# Altium schematic sheet Digital In-Out.SchDoc
size A2
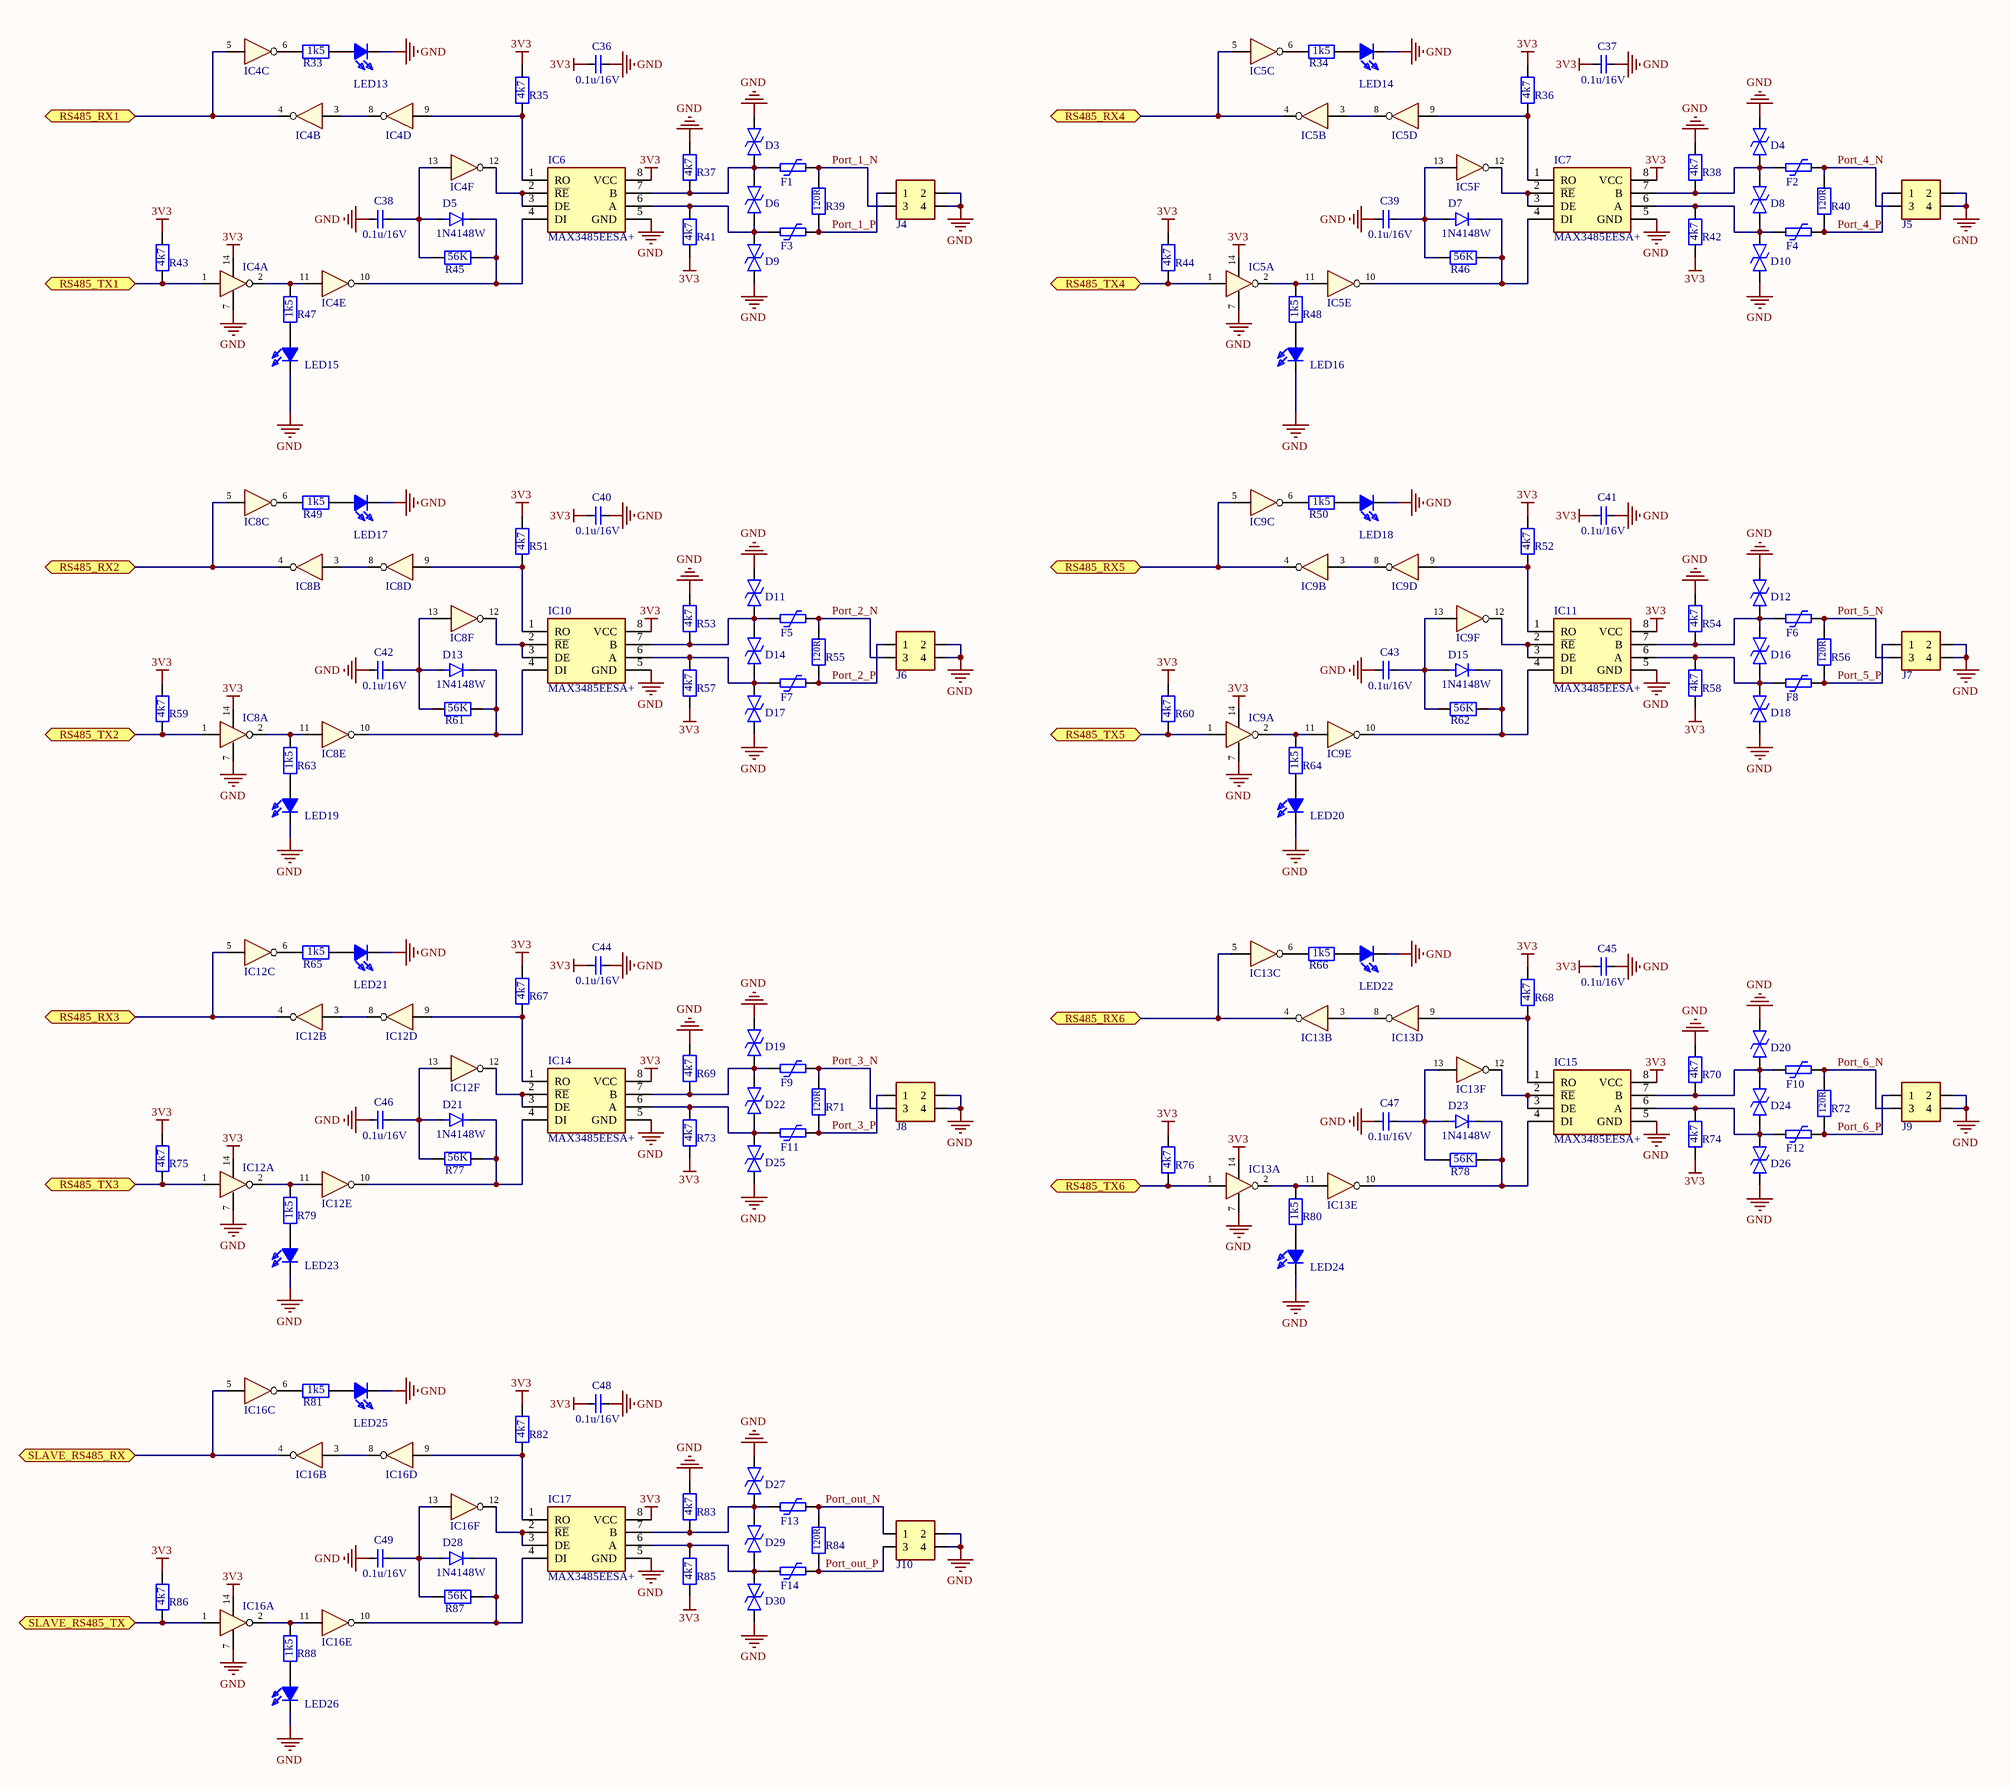
[diagram p0: Digital In-Out.SchDoc]

## Parts
C36  0.1u/16V  [CAPC1608X95N]
C37  0.1u/16V  [CAPC1608X95N]
C38  0.1u/16V  [CAPC1608X95N]
C39  0.1u/16V  [CAPC1608X95N]
C40  0.1u/16V  [CAPC1608X95N]
C41  0.1u/16V  [CAPC1608X95N]
C42  0.1u/16V  [CAPC1608X95N]
C43  0.1u/16V  [CAPC1608X95N]
C44  0.1u/16V  [CAPC1608X95N]
C45  0.1u/16V  [CAPC1608X95N]
C46  0.1u/16V  [CAPC1608X95N]
C47  0.1u/16V  [CAPC1608X95N]
C48  0.1u/16V  [CAPC1608X95N]
C49  0.1u/16V  [CAPC1608X95N]
D3  SMAJ6.8CA  [DIOM5226X247N]  (value not drawn)
D4  SMAJ6.8CA  [DIOM5226X247N]  (value not drawn)
D5  1N4148W  [SOD3716X135N]
D6  SMAJ6.8CA  [DIOM5226X247N]  (value not drawn)
D7  1N4148W  [SOD3716X135N]
D8  SMAJ6.8CA  [DIOM5226X247N]  (value not drawn)
D9  SMAJ6.8CA  [DIOM5226X247N]  (value not drawn)
D10  SMAJ6.8CA  [DIOM5226X247N]  (value not drawn)
D11  SMAJ6.8CA  [DIOM5226X247N]  (value not drawn)
D12  SMAJ6.8CA  [DIOM5226X247N]  (value not drawn)
D13  1N4148W  [SOD3716X135N]
D14  SMAJ6.8CA  [DIOM5226X247N]  (value not drawn)
D15  1N4148W  [SOD3716X135N]
D16  SMAJ6.8CA  [DIOM5226X247N]  (value not drawn)
D17  SMAJ6.8CA  [DIOM5226X247N]  (value not drawn)
D18  SMAJ6.8CA  [DIOM5226X247N]  (value not drawn)
D19  SMAJ6.8CA  [DIOM5226X247N]  (value not drawn)
D20  SMAJ6.8CA  [DIOM5226X247N]  (value not drawn)
D21  1N4148W  [SOD3716X135N]
D22  SMAJ6.8CA  [DIOM5226X247N]  (value not drawn)
D23  1N4148W  [SOD3716X135N]
D24  SMAJ6.8CA  [DIOM5226X247N]  (value not drawn)
D25  SMAJ6.8CA  [DIOM5226X247N]  (value not drawn)
D26  SMAJ6.8CA  [DIOM5226X247N]  (value not drawn)
D27  SMAJ6.8CA  [DIOM5226X247N]  (value not drawn)
D28  1N4148W  [SOD3716X135N]
D29  SMAJ6.8CA  [DIOM5226X247N]  (value not drawn)
D30  SMAJ6.8CA  [DIOM5226X247N]  (value not drawn)
F1  USHT020KX  [MFUSHT020KX362]  (value not drawn)
F2  USHT020KX  [MFUSHT020KX362]  (value not drawn)
F3  USHT020KX  [MFUSHT020KX362]  (value not drawn)
F4  USHT020KX  [MFUSHT020KX362]  (value not drawn)
F5  USHT020KX  [MFUSHT020KX362]  (value not drawn)
F6  USHT020KX  [MFUSHT020KX362]  (value not drawn)
F7  USHT020KX  [MFUSHT020KX362]  (value not drawn)
F8  USHT020KX  [MFUSHT020KX362]  (value not drawn)
F9  USHT020KX  [MFUSHT020KX362]  (value not drawn)
F10  USHT020KX  [MFUSHT020KX362]  (value not drawn)
F11  USHT020KX  [MFUSHT020KX362]  (value not drawn)
F12  USHT020KX  [MFUSHT020KX362]  (value not drawn)
F13  USHT020KX  [MFUSHT020KX362]  (value not drawn)
F14  USHT020KX  [MFUSHT020KX362]  (value not drawn)
IC4  nverters Hex A 595-CD4069UBMT  [SOIC127P600X175-14N]  (value not drawn)  (parts A,B,C,D,E,F of 6)
IC5  nverters Hex A 595-CD4069UBMT  [SOIC127P600X175-14N]  (value not drawn)  (parts A,B,C,D,E,F of 6)
IC6  MAX3485EESA+  [SOIC127P600X175-8N]
IC7  MAX3485EESA+  [SOIC127P600X175-8N]
IC8  nverters Hex A 595-CD4069UBMT  [SOIC127P600X175-14N]  (value not drawn)  (parts A,B,C,D,E,F of 6)
IC9  nverters Hex A 595-CD4069UBMT  [SOIC127P600X175-14N]  (value not drawn)  (parts A,B,C,D,E,F of 6)
IC10  MAX3485EESA+  [SOIC127P600X175-8N]
IC11  MAX3485EESA+  [SOIC127P600X175-8N]
IC12  nverters Hex A 595-CD4069UBMT  [SOIC127P600X175-14N]  (value not drawn)  (parts A,B,C,D,E,F of 6)
IC13  nverters Hex A 595-CD4069UBMT  [SOIC127P600X175-14N]  (value not drawn)  (parts A,B,C,D,E,F of 6)
IC14  MAX3485EESA+  [SOIC127P600X175-8N]
IC15  MAX3485EESA+  [SOIC127P600X175-8N]
IC16  nverters Hex A 595-CD4069UBMT  [SOIC127P600X175-14N]  (value not drawn)  (parts A,B,C,D,E,F of 6)
IC17  MAX3485EESA+  [SOIC127P600X175-8N]
J4  Connector THD 4 position 0.165" (4.20mm)  [RHDR4W125P550X420_2X2_960X960X1310P]  (value not drawn)
J5  Connector THD 4 position 0.165" (4.20mm)  [RHDR4W125P550X420_2X2_960X960X1310P]  (value not drawn)
J6  Connector THD 4 position 0.165" (4.20mm)  [RHDR4W125P550X420_2X2_960X960X1310P]  (value not drawn)
J7  Connector THD 4 position 0.165" (4.20mm)  [RHDR4W125P550X420_2X2_960X960X1310P]  (value not drawn)
J8  Connector THD 4 position 0.165" (4.20mm)  [RHDR4W125P550X420_2X2_960X960X1310P]  (value not drawn)
J9  Connector THD 4 position 0.165" (4.20mm)  [RHDR4W125P550X420_2X2_960X960X1310P]  (value not drawn)
J10  Connector THD 4 position 0.165" (4.20mm)  [RHDR4W125P550X420_2X2_960X960X1310P]  (value not drawn)
LED13  LED0603_BLUE  [LEDC1608X80N]  (value not drawn)
LED14  LED0603_BLUE  [LEDC1608X80N]  (value not drawn)
LED15  LED0603_BLUE  [LEDC1608X80N]  (value not drawn)
LED16  LED0603_BLUE  [LEDC1608X80N]  (value not drawn)
LED17  LED0603_BLUE  [LEDC1608X80N]  (value not drawn)
LED18  LED0603_BLUE  [LEDC1608X80N]  (value not drawn)
LED19  LED0603_BLUE  [LEDC1608X80N]  (value not drawn)
LED20  LED0603_BLUE  [LEDC1608X80N]  (value not drawn)
LED21  LED0603_BLUE  [LEDC1608X80N]  (value not drawn)
LED22  LED0603_BLUE  [LEDC1608X80N]  (value not drawn)
LED23  LED0603_BLUE  [LEDC1608X80N]  (value not drawn)
LED24  LED0603_BLUE  [LEDC1608X80N]  (value not drawn)
LED25  LED0603_BLUE  [LEDC1608X80N]  (value not drawn)
LED26  LED0603_BLUE  [LEDC1608X80N]  (value not drawn)
R33  Res 0603 1k5  [RESC1608X55N]  (value not drawn)
R34  Res 0603 1k5  [RESC1608X55N]  (value not drawn)
R35  Res 0603 4k7  [RESC1608X55N]  (value not drawn)
R36  Res 0603 4k7  [RESC1608X55N]  (value not drawn)
R37  Res 0603 4k7  [RESC1608X55N]  (value not drawn)
R38  Res 0603 4k7  [RESC1608X55N]  (value not drawn)
R39  120R  [RESC1608X55N]  (value not drawn)
R40  120R  [RESC1608X55N]  (value not drawn)
R41  Res 0603 4k7  [RESC1608X55N]  (value not drawn)
R42  Res 0603 4k7  [RESC1608X55N]  (value not drawn)
R43  Res 0603 4k7  [RESC1608X55N]  (value not drawn)
R44  Res 0603 4k7  [RESC1608X55N]  (value not drawn)
R45  56k  [RESC1608X55N]  (value not drawn)
R46  56k  [RESC1608X55N]  (value not drawn)
R47  Res 0603 1k5  [RESC1608X55N]  (value not drawn)
R48  Res 0603 1k5  [RESC1608X55N]  (value not drawn)
R49  Res 0603 1k5  [RESC1608X55N]  (value not drawn)
R50  Res 0603 1k5  [RESC1608X55N]  (value not drawn)
R51  Res 0603 4k7  [RESC1608X55N]  (value not drawn)
R52  Res 0603 4k7  [RESC1608X55N]  (value not drawn)
R53  Res 0603 4k7  [RESC1608X55N]  (value not drawn)
R54  Res 0603 4k7  [RESC1608X55N]  (value not drawn)
R55  120R  [RESC1608X55N]  (value not drawn)
R56  120R  [RESC1608X55N]  (value not drawn)
R57  Res 0603 4k7  [RESC1608X55N]  (value not drawn)
R58  Res 0603 4k7  [RESC1608X55N]  (value not drawn)
R59  Res 0603 4k7  [RESC1608X55N]  (value not drawn)
R60  Res 0603 4k7  [RESC1608X55N]  (value not drawn)
R61  56k  [RESC1608X55N]  (value not drawn)
R62  56k  [RESC1608X55N]  (value not drawn)
R63  Res 0603 1k5  [RESC1608X55N]  (value not drawn)
R64  Res 0603 1k5  [RESC1608X55N]  (value not drawn)
R65  Res 0603 1k5  [RESC1608X55N]  (value not drawn)
R66  Res 0603 1k5  [RESC1608X55N]  (value not drawn)
R67  Res 0603 4k7  [RESC1608X55N]  (value not drawn)
R68  Res 0603 4k7  [RESC1608X55N]  (value not drawn)
R69  Res 0603 4k7  [RESC1608X55N]  (value not drawn)
R70  Res 0603 4k7  [RESC1608X55N]  (value not drawn)
R71  120R  [RESC1608X55N]  (value not drawn)
R72  120R  [RESC1608X55N]  (value not drawn)
R73  Res 0603 4k7  [RESC1608X55N]  (value not drawn)
R74  Res 0603 4k7  [RESC1608X55N]  (value not drawn)
R75  Res 0603 4k7  [RESC1608X55N]  (value not drawn)
R76  Res 0603 4k7  [RESC1608X55N]  (value not drawn)
R77  56k  [RESC1608X55N]  (value not drawn)
R78  56k  [RESC1608X55N]  (value not drawn)
R79  Res 0603 1k5  [RESC1608X55N]  (value not drawn)
R80  Res 0603 1k5  [RESC1608X55N]  (value not drawn)
R81  Res 0603 1k5  [RESC1608X55N]  (value not drawn)
R82  Res 0603 4k7  [RESC1608X55N]  (value not drawn)
R83  Res 0603 4k7  [RESC1608X55N]  (value not drawn)
R84  120R  [RESC1608X55N]  (value not drawn)
R85  Res 0603 4k7  [RESC1608X55N]  (value not drawn)
R86  Res 0603 4k7  [RESC1608X55N]  (value not drawn)
R87  56k  [RESC1608X55N]  (value not drawn)
R88  Res 0603 1k5  [RESC1608X55N]  (value not drawn)

## Ports
RS485_RX1 (bidir), RS485_RX2 (bidir), RS485_RX3 (bidir), RS485_RX4 (bidir), RS485_RX5 (bidir), RS485_RX6 (bidir), RS485_TX1 (bidir), RS485_TX2 (bidir), RS485_TX3 (bidir), RS485_TX4 (bidir), RS485_TX5 (bidir), RS485_TX6 (bidir), SLAVE_RS485_RX (bidir), SLAVE_RS485_TX (bidir)

## Nets
3V3: C36.1 C37.1 C40.1 C41.1 C44.1 C45.1 C48.1 IC4.14(VDD) IC5.14(VDD) IC6.8(VCC) IC7.8(VCC) IC8.14(VDD) IC9.14(VDD) IC10.8(VCC) IC11.8(VCC) IC12.14(VDD) IC13.14(VDD) IC14.8(VCC) IC15.8(VCC) IC16.14(VDD) IC17.8(VCC) R35.2 R36.2 R41.1 R42.1 R43.2 R44.2 R51.2 R52.2 R57.1 R58.1 R59.2 R60.2 R67.2 R68.2 R73.1 R74.1 R75.2 R76.2 R82.2 R85.1 R86.2
GND: C36.2 C37.2 C38.1 C39.1 C40.2 C41.2 C42.1 C43.1 C44.2 C45.2 C46.1 C47.1 C48.2 C49.1 D3.2 D4.2 D9.1 D10.1 D11.2 D12.2 D17.1 D18.1 D19.2 D20.2 D25.1 D26.1 D27.2 D30.1 IC4.7(VSS) IC5.7(VSS) IC6.5(GND) IC7.5(GND) IC8.7(VSS) IC9.7(VSS) IC10.5(GND) IC11.5(GND) IC12.7(VSS) IC13.7(VSS) IC14.5(GND) IC15.5(GND) IC16.7(VSS) IC17.5(GND) J4.2 J4.4 J5.2 J5.4 J6.2 J6.4 J7.2 J7.4 J8.2 J8.4 J9.2 J9.4 J10.2 J10.4 LED13.1(K) LED14.1(K) LED15.1(K) LED16.1(K) LED17.1(K) LED18.1(K) LED19.1(K) LED20.1(K) LED21.1(K) LED22.1(K) LED23.1(K) LED24.1(K) LED25.1(K) LED26.1(K) R37.2 R38.2 R53.2 R54.2 R69.2 R70.2 R83.2
Port_1_N: F1.2 J4.3 R39.2
Port_1_P: F3.2 J4.1 R39.1
Port_2_N: F5.2 J6.3 R55.2
Port_2_P: F7.2 J6.1 R55.1
Port_3_N: F9.2 J8.3 R71.2
Port_3_P: F11.2 J8.1 R71.1
Port_4_N: F2.2 J5.3 R40.2
Port_4_P: F4.2 J5.1 R40.1
Port_5_N: F6.2 J7.3 R56.2
Port_5_P: F8.2 J7.1 R56.1
Port_6_N: F10.2 J9.3 R72.2
Port_6_P: F12.2 J9.1 R72.1
Port_out_N: F13.2 J10.1 R84.2
Port_out_P: F14.2 J10.3 R84.1
RS485_RX1: IC4.4(H=~{B}) IC4.5(C) ; port RS485_RX1
RS485_RX2: IC8.4(H=~{B}) IC8.5(C) ; port RS485_RX2
RS485_RX3: IC12.4(H=~{B}) IC12.5(C) ; port RS485_RX3
RS485_RX4: IC5.4(H=~{B}) IC5.5(C) ; port RS485_RX4
RS485_RX5: IC9.4(H=~{B}) IC9.5(C) ; port RS485_RX5
RS485_RX6: IC13.4(H=~{B}) IC13.5(C) ; port RS485_RX6
RS485_TX1: IC4.1(A) R43.1 ; port RS485_TX1
RS485_TX2: IC8.1(A) R59.1 ; port RS485_TX2
RS485_TX3: IC12.1(A) R75.1 ; port RS485_TX3
RS485_TX4: IC5.1(A) R44.1 ; port RS485_TX4
RS485_TX5: IC9.1(A) R60.1 ; port RS485_TX5
RS485_TX6: IC13.1(A) R76.1 ; port RS485_TX6
SLAVE_RS485_RX: IC16.4(H=~{B}) IC16.5(C) ; port SLAVE_RS485_RX
SLAVE_RS485_TX: IC16.1(A) R86.1 ; port SLAVE_RS485_TX
NetC38_2: C38.2 D5.2(A) IC4.13(F) R45.1
NetC39_2: C39.2 D7.2(A) IC5.13(F) R46.1
NetC42_2: C42.2 D13.2(A) IC8.13(F) R61.1
NetC43_2: C43.2 D15.2(A) IC9.13(F) R62.1
NetC46_2: C46.2 D21.2(A) IC12.13(F) R77.1
NetC47_2: C47.2 D23.2(A) IC13.13(F) R78.1
NetC49_2: C49.2 D28.2(A) IC16.13(F) R87.1
NetD3_1: D3.1 D6.2 F1.1 IC6.7(B) R37.1
NetD4_1: D4.1 D8.2 F2.1 IC7.7(B) R38.1
NetD5_1: D5.1(K) IC4.10(K=~{E}) IC6.4(DI) R45.2
NetD6_1: D6.1 D9.2 F3.1 IC6.6(A) R41.2
NetD7_1: D7.1(K) IC5.10(K=~{E}) IC7.4(DI) R46.2
NetD8_1: D8.1 D10.2 F4.1 IC7.6(A) R42.2
NetD11_1: D11.1 D14.2 F5.1 IC10.7(B) R53.1
NetD12_1: D12.1 D16.2 F6.1 IC11.7(B) R54.1
NetD13_1: D13.1(K) IC8.10(K=~{E}) IC10.4(DI) R61.2
NetD14_1: D14.1 D17.2 F7.1 IC10.6(A) R57.2
NetD15_1: D15.1(K) IC9.10(K=~{E}) IC11.4(DI) R62.2
NetD16_1: D16.1 D18.2 F8.1 IC11.6(A) R58.2
NetD19_1: D19.1 D22.2 F9.1 IC14.7(B) R69.1
NetD20_1: D20.1 D24.2 F10.1 IC15.7(B) R70.1
NetD21_1: D21.1(K) IC12.10(K=~{E}) IC14.4(DI) R77.2
NetD22_1: D22.1 D25.2 F11.1 IC14.6(A) R73.2
NetD23_1: D23.1(K) IC13.10(K=~{E}) IC15.4(DI) R78.2
NetD24_1: D24.1 D26.2 F12.1 IC15.6(A) R74.2
NetD27_1: D27.1 D29.2 F13.1 IC17.7(B) R83.1
NetD28_1: D28.1(K) IC16.10(K=~{E}) IC17.4(DI) R87.2
NetD29_1: D29.1 D30.2 F14.1 IC17.6(A) R85.2
NetIC4_2: IC4.2(G=~{A}) IC4.11(E) R47.2
NetIC4_3: IC4.3(B) IC4.8(J=~{D})
NetIC4_6: IC4.6(I=~{C}) R33.1
NetIC4_9: IC4.9(D) IC6.1(RO) R35.1
NetIC4_12: IC4.12(L=~{F}) IC6.2(~{RE}) IC6.3(DE)
NetIC5_2: IC5.2(G=~{A}) IC5.11(E) R48.2
NetIC5_3: IC5.3(B) IC5.8(J=~{D})
NetIC5_6: IC5.6(I=~{C}) R34.1
NetIC5_9: IC5.9(D) IC7.1(RO) R36.1
NetIC5_12: IC5.12(L=~{F}) IC7.2(~{RE}) IC7.3(DE)
NetIC8_2: IC8.2(G=~{A}) IC8.11(E) R63.2
NetIC8_3: IC8.3(B) IC8.8(J=~{D})
NetIC8_6: IC8.6(I=~{C}) R49.1
NetIC8_9: IC8.9(D) IC10.1(RO) R51.1
NetIC8_12: IC8.12(L=~{F}) IC10.2(~{RE}) IC10.3(DE)
NetIC9_2: IC9.2(G=~{A}) IC9.11(E) R64.2
NetIC9_3: IC9.3(B) IC9.8(J=~{D})
NetIC9_6: IC9.6(I=~{C}) R50.1
NetIC9_9: IC9.9(D) IC11.1(RO) R52.1
NetIC9_12: IC9.12(L=~{F}) IC11.2(~{RE}) IC11.3(DE)
NetIC12_2: IC12.2(G=~{A}) IC12.11(E) R79.2
NetIC12_3: IC12.3(B) IC12.8(J=~{D})
NetIC12_6: IC12.6(I=~{C}) R65.1
NetIC12_9: IC12.9(D) IC14.1(RO) R67.1
NetIC12_12: IC12.12(L=~{F}) IC14.2(~{RE}) IC14.3(DE)
NetIC13_2: IC13.2(G=~{A}) IC13.11(E) R80.2
NetIC13_3: IC13.3(B) IC13.8(J=~{D})
NetIC13_6: IC13.6(I=~{C}) R66.1
NetIC13_9: IC13.9(D) IC15.1(RO) R68.1
NetIC13_12: IC13.12(L=~{F}) IC15.2(~{RE}) IC15.3(DE)
NetIC16_2: IC16.2(G=~{A}) IC16.11(E) R88.2
NetIC16_3: IC16.3(B) IC16.8(J=~{D})
NetIC16_6: IC16.6(I=~{C}) R81.1
NetIC16_9: IC16.9(D) IC17.1(RO) R82.1
NetIC16_12: IC16.12(L=~{F}) IC17.2(~{RE}) IC17.3(DE)
NetLED13_2: LED13.2(A) R33.2
NetLED14_2: LED14.2(A) R34.2
NetLED15_2: LED15.2(A) R47.1
NetLED16_2: LED16.2(A) R48.1
NetLED17_2: LED17.2(A) R49.2
NetLED18_2: LED18.2(A) R50.2
NetLED19_2: LED19.2(A) R63.1
NetLED20_2: LED20.2(A) R64.1
NetLED21_2: LED21.2(A) R65.2
NetLED22_2: LED22.2(A) R66.2
NetLED23_2: LED23.2(A) R79.1
NetLED24_2: LED24.2(A) R80.1
NetLED25_2: LED25.2(A) R81.2
NetLED26_2: LED26.2(A) R88.1

## Notes on the sheet
- (in symbol Res 0603 1k5) 1k5
- (in symbol Res 0603 4k7) 4k7
- (in symbol Res 0603 56k) 56K

## Library data of the parts
C36-C49 = Cap 0603 0.1u/16V: Multilayer Ceramic Capacitors MLCC - SMD/SMT 16V 100pF C0G 0603 1%; Manufacturer_Name: KEMET; Manufacturer_Part_Number: C0603C101F4GAC; Datasheet Link: https://content.kemet.com/datasheets/KEM_C1003_C0G_SMD.pdf; Height: 0.87mm; Mouser Part Number: 80-C0603C101F4G; Mouser Price/Stock: https://www.mouser.com/Search/Refine.aspx?Keyword=80-C0603C101F4G
D3 D4 D6 D8-D12 D14 D16-D20 D22 D24-D27 D29 D30 = SMAJ6.8CA: TVS Diode (Bi-directional) - 400W 10.5V 38.1A 5.8V 6.45VSMA(D; Manufacturer_Name: Vishay; Datasheet Link: https://www.kynix.com/Detail/311145/SMAJ6.8CA.html; Height: 2.47mm; Manufacturer_Part_Number: SMAJ6.8CA
D5 D7 D13 D15 D21 D23 D28 = 1N4148W: Diode; Manufacturer_Name: Vishay; Manufacturer_Part_Number: 1N4148W-E3-08; Datasheet Link: http://www.vishay.com/docs/85748/1n4148w.pdf; Height: 1.35mm; Mouser Part Number: 78-1N4148W-E3-08; Mouser Price/Stock: https://www.mouser.co.uk/ProductDetail/Vishay-Semiconductors/1N4148W-E3-08?qs=bTzheeSci6TVjpxfjjRVMw%3D%3D; Arrow Part Number: 1N4148W-E3-08; Arrow Price/Stock: https://www.arrow.com/en/products/1n4148w-e3-08/vishay?region=europe
F1-F14 = USHT020KX: Resettable Fuses - PPTC 1210 High Temp SMD Polymer PTC 0.20A/36V; Manufacturer_Name: Bourns; Manufacturer_Part_Number: MF-USHT020KX/36-2; Datasheet Link: https://www.bourns.com/docs/product-datasheets/mf-usht.pdf; Height: 0.85mm; Mouser Part Number: 652-MF-USHT020KX/36; Mouser Price/Stock: https://www.mouser.co.uk/ProductDetail/Bourns/MF-USHT020KX-36-2?qs=7%2F6SraaimPQhNMgY%2F2x66A%3D%3D
IC4 IC5 IC8 IC9 IC12 IC13 IC16 = CD4069UBM: Inverters Hex A 595-CD4069UBMT; Manufacturer_Name: Texas Instruments; Datasheet Link: http://www.ti.com/lit/gpn/cd4069ub; Height: 1.75mm; Manufacturer_Part_Number: CD4069UBM; Mouser Part Number: 595-CD4069UBM; Mouser Price/Stock: https://www.mouser.co.uk/ProductDetail/Texas-Instruments/CD4069UBM?qs=gqbMQSs93zMh7cPmoolhRg%3D%3D; Arrow Part Number: CD4069UBM; Arrow Price/Stock: https://www.arrow.com/en/products/cd4069ubm/texas-instruments?region=nac
IC6 IC7 IC10 IC11 IC14 IC15 IC17 = MAX3485EESA+: Integrated Circuit; Manufacturer_Name: Analog Devices; Datasheet Link: https://datasheet.datasheetarchive.com/originals/distributors/Datasheets-18/DSA-341145.pdf; Height: 1.75mm; Manufacturer_Part_Number: MAX3485EESA+; Mouser Part Number: 700-MAX3485EESA; Mouser Price/Stock: https://www.mouser.co.uk/ProductDetail/Maxim-Integrated/MAX3485EESA%2b?qs=1THa7WoU59HLsdsozrMCeQ%3D%3D; Arrow Part Number: MAX3485EESA+; Arrow Price/Stock: https://www.arrow.com/en/products/max3485eesa/maxim-integrated?region=nac
J4-J10 = Connector 2x2: Connector Header Through Hole 4 position 0.165" (4.20mm); Manufacturer_Name: Molex; Manufacturer_Part_Number: 0039281043; Datasheet Link: https://www.molex.com/pdm_docs/sd/039281043_sd.pdf; Height: 13.1mm; Mouser Part Number: N/A; Mouser Price/Stock: https://www.mouser.co.uk/ProductDetail/Molex/0039281043?qs=PBcRNPEHKsoXjYsIax3FJA%3D%3D; Arrow Part Number: 0039281043; Arrow Price/Stock: https://www.arrow.com/en/products/0039281043/molex?utm_currency=USD&region=nac
LED13-LED26 = LED0603_BLUE: LED; Manufacturer_Name: Wurth Elektronik; Manufacturer_Part_Number: 150060BS75000; Datasheet Link: https://componentsearchengine.com/Datasheets/2/150060BS75000.pdf; Height: 0.8mm; Mouser Part Number: 710-150060BS75000; Mouser Price/Stock: https://www.mouser.co.uk/ProductDetail/Wurth-Elektronik/150060BS75000?qs=LlUlMxKIyB2DLLpXQThavA%3D%3D
R33 R34 R47-R50 R63-R66 R79-R81 R88 = Res 0603 1k5: Thick Film Resistors - SMD 1.5 kOhms 100mW 0603 1%; Manufacturer_Name: KEMET; Manufacturer_Part_Number: RC0603FR-071K5L; Datasheet Link: http://www.yageo.com/documents/recent/PYu-RC0603_51_RoHS_L_v5.pdf; Height: 0.55mm; Mouser Part Number: 603-RC0603FR-071K5L; Mouser Price/Stock: https://www.mouser.co.uk/ProductDetail/YAGEO/RC0603FR-071K5L?qs=VU8sRB4EgwBMt9nc4XGNgA%3D%3D; Arrow Part Number: RC0603FR-071K5L; Arrow Price/Stock: https://www.arrow.com/en/products/rc0603fr-071k5l/yageo?region=nac
R35-R38 R41-R44 R51-R54 R57-R60 R67-R70 R73-R76 R82 R83 R85 R86 = Res 0603 4k7: Thick Film Resistors - SMD 0603 4.7Kohms 0.2W 1% AEC-Q200; Manufacturer_Name: Panasonic; Manufacturer_Part_Number: ERJ-P03F4701V; Datasheet Link: http://industrial.panasonic.com/cdbs/www-data/pdf/RDA0000/AOA0000C102.pdf; Height: 0.55mm; Mouser Part Number: 667-ERJ-P03F4701V; Mouser Price/Stock: http://www.mouser.com/Search/ProductDetail.aspx?qs=18kBAoNi3c9lrldXCbY57g%3d%3d
R39 R40 R55 R56 R71 R72 R84 = Res 0603 120R: Thick Film Resistors - SMD 0603 120ohms 1% AEC-Q200; Manufacturer_Name: Panasonic; Manufacturer_Part_Number: ERJ-3EKF1200V; Datasheet Link: http://industrial.panasonic.com/cdbs/www-data/pdf/RDA0000/AOA0000C86.pdf; Height: 0.55mm; Mouser Part Number: 667-ERJ-3EKF1200V; Mouser Price/Stock: https://www.mouser.co.uk/ProductDetail/Panasonic/ERJ-3EKF1200V?qs=iBwFsHVUAOfkZ4Bj0qjBGg%3D%3D; Arrow Part Number: ERJ-3EKF1200V; Arrow Price/Stock: https://www.arrow.com/en/products/erj-3ekf1200v/panasonic?region=nac
R45 R46 R61 R62 R77 R78 R87 = Res 0603 56k: Thick Film Resistors - SMD 0603 56Kohms 1% AEC-Q200; Manufacturer_Name: Panasonic; Manufacturer_Part_Number: ERJ-3EKF5602V; Datasheet Link: http://industrial.panasonic.com/cdbs/www-data/pdf/RDA0000/AOA0000C86.pdf; Height: 0.55mm; Mouser Part Number: 667-ERJ-3EKF5602V; Mouser Price/Stock: https://www.mouser.com/Search/Refine.aspx?Keyword=667-ERJ-3EKF5602V; Arrow Part Number: ERJ-3EKF5602V; Arrow Price/Stock: https://www.arrow.com/en/products/erj-3ekf5602v/panasonic